# EAGLE schematic AM-Crystal-RX-LM324 (EAGLE 7.6.0)
Passive Aircraft Receiver using Crystal Detector, LM324 Version http://www.techlib.com/electronics/aircraft.htm http://radio-circuits.blogspot.ch/2011/02/passive-air-band-receiver.html http://www.vk6fh.com/vk6fh/amvhfpassiverx.htm http://www.vk2zay.net/article/127 http://electronics-diy.com/aircraft-transmission-receiver.php
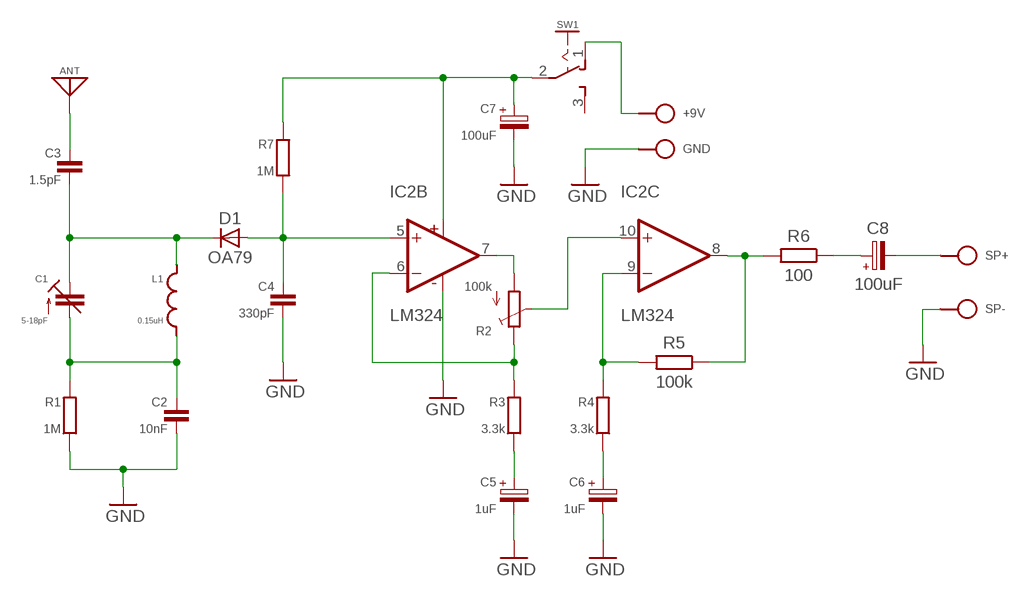
[diagram p0: schematic, sheet 1]

## Parts
+9V  BAT+  SPAD  [SPAD]
ANT  ANT  [SPAD]
C1  5-18pF  C-TR-PH201272222-808-2PIN  [TRIM-2222-808]
C2  10nF  C050-025X075/V  [C050-025X075/V]
C3  1.5pF  C050-020X036  [C050-020X036]
C4  330pF  C050-024X044/V  [C050-024X044/V]
C5  1uF  CPOLE2,5-4/V  [E2.5-4/V]
C6  1uF  CPOLE2,5-3/V  [E2,5-3/V]
C7  100uF  CPOLE5-5/V  [E5-5/V]
C8  100uF  CPOLE2,5-5/V  [E2,5-5/V]
D1  OA79  OA7918/V  [OA79-18/V]
GND  BAT-  SPAD  [SPAD]
IC2  LM324  LM324N  [DIL14]
L1  0.15uH  L-SHORT04-5/5  [L-04-5/5]
R1  1M  R0202/7-V  [0202/7-V]
R2  100k  TRIM  [B64Y]
R3  3.3k  R0202/7  [0202/7]
R4  3.3k  R0202/7-V  [0202/7-V]
R5  100k  R0202/7-V  [0202/7-V]
R6  100  R0202/7-V  [0202/7-V]
R7  1M  R0202/7-V  [0202/7-V]
SP+  SPKR+  SPAD  [SPAD]
SP-  SPKR-  SPAD  [SPAD]
SW1  SL-SW-1P-2T-H  [SLSW-1P2T-H]

## Nets
A: IC2.7(B:OUT) R2.A
E: IC2.6(B:-IN) R2.E R3.1
GND: C2.2 C4.2 C5.- C6.- C7.- GND.1 IC2.11(P:V-) R1.2 SP-.1
N$1: C4.1 D1.A IC2.5(B:+IN) R7.2
N$2: C7.+ IC2.4(P:V+) R7.1 SW1.2(P)
N$3: C1.1(A) C2.1 L1.1 R1.1
N$5: C1.2(E) C3.2 D1.C L1.2
N$6: ANT.1 C3.1
N$9: IC2.8(C:OUT) R5.2 R6.1
N$10: IC2.9(C:-IN) R4.1 R5.1
N$11: C5.+ R3.2
N$12: C6.+ R4.2
N$13: C8.+ R6.2
N$14: C8.- SP+.1
N$15: +9V.1 SW1.1(O)
S: IC2.10(C:+IN) R2.S
Unconnected: IC2.1(A:OUT) IC2.2(A:-IN) IC2.3(A:+IN) IC2.12(D:+IN) IC2.13(D:-IN) IC2.14(D:OUT) SW1.3(S)

## Library data of the parts
+9V GND SP+ SP- = pad:SPAD
ANT = pad:ANT
C1 = cap-trim:C-TR-PH20127
C2-C4 = c:C: CAPACITOR, European symbol
C5-C8 = c:CPOL: POLARIZED CAPACITOR, European symbol
D1 = d:OA79
IC2 = ic:LM324: Single Supply Quad Operational Amplifiers http://www.ti.com/lit/ds/symlink/lm324.pdf
L1 = r:L-SHORT
R1 R3-R7 = r:R: RESISTOR, European symbol
R2 = r:TRIM: POTENTIOMETER
SW1 = sw:SL-SW-1P-2T